# EAGLE schematic SNARFBASE-v03jj-232-buck (EAGLE 5.11)
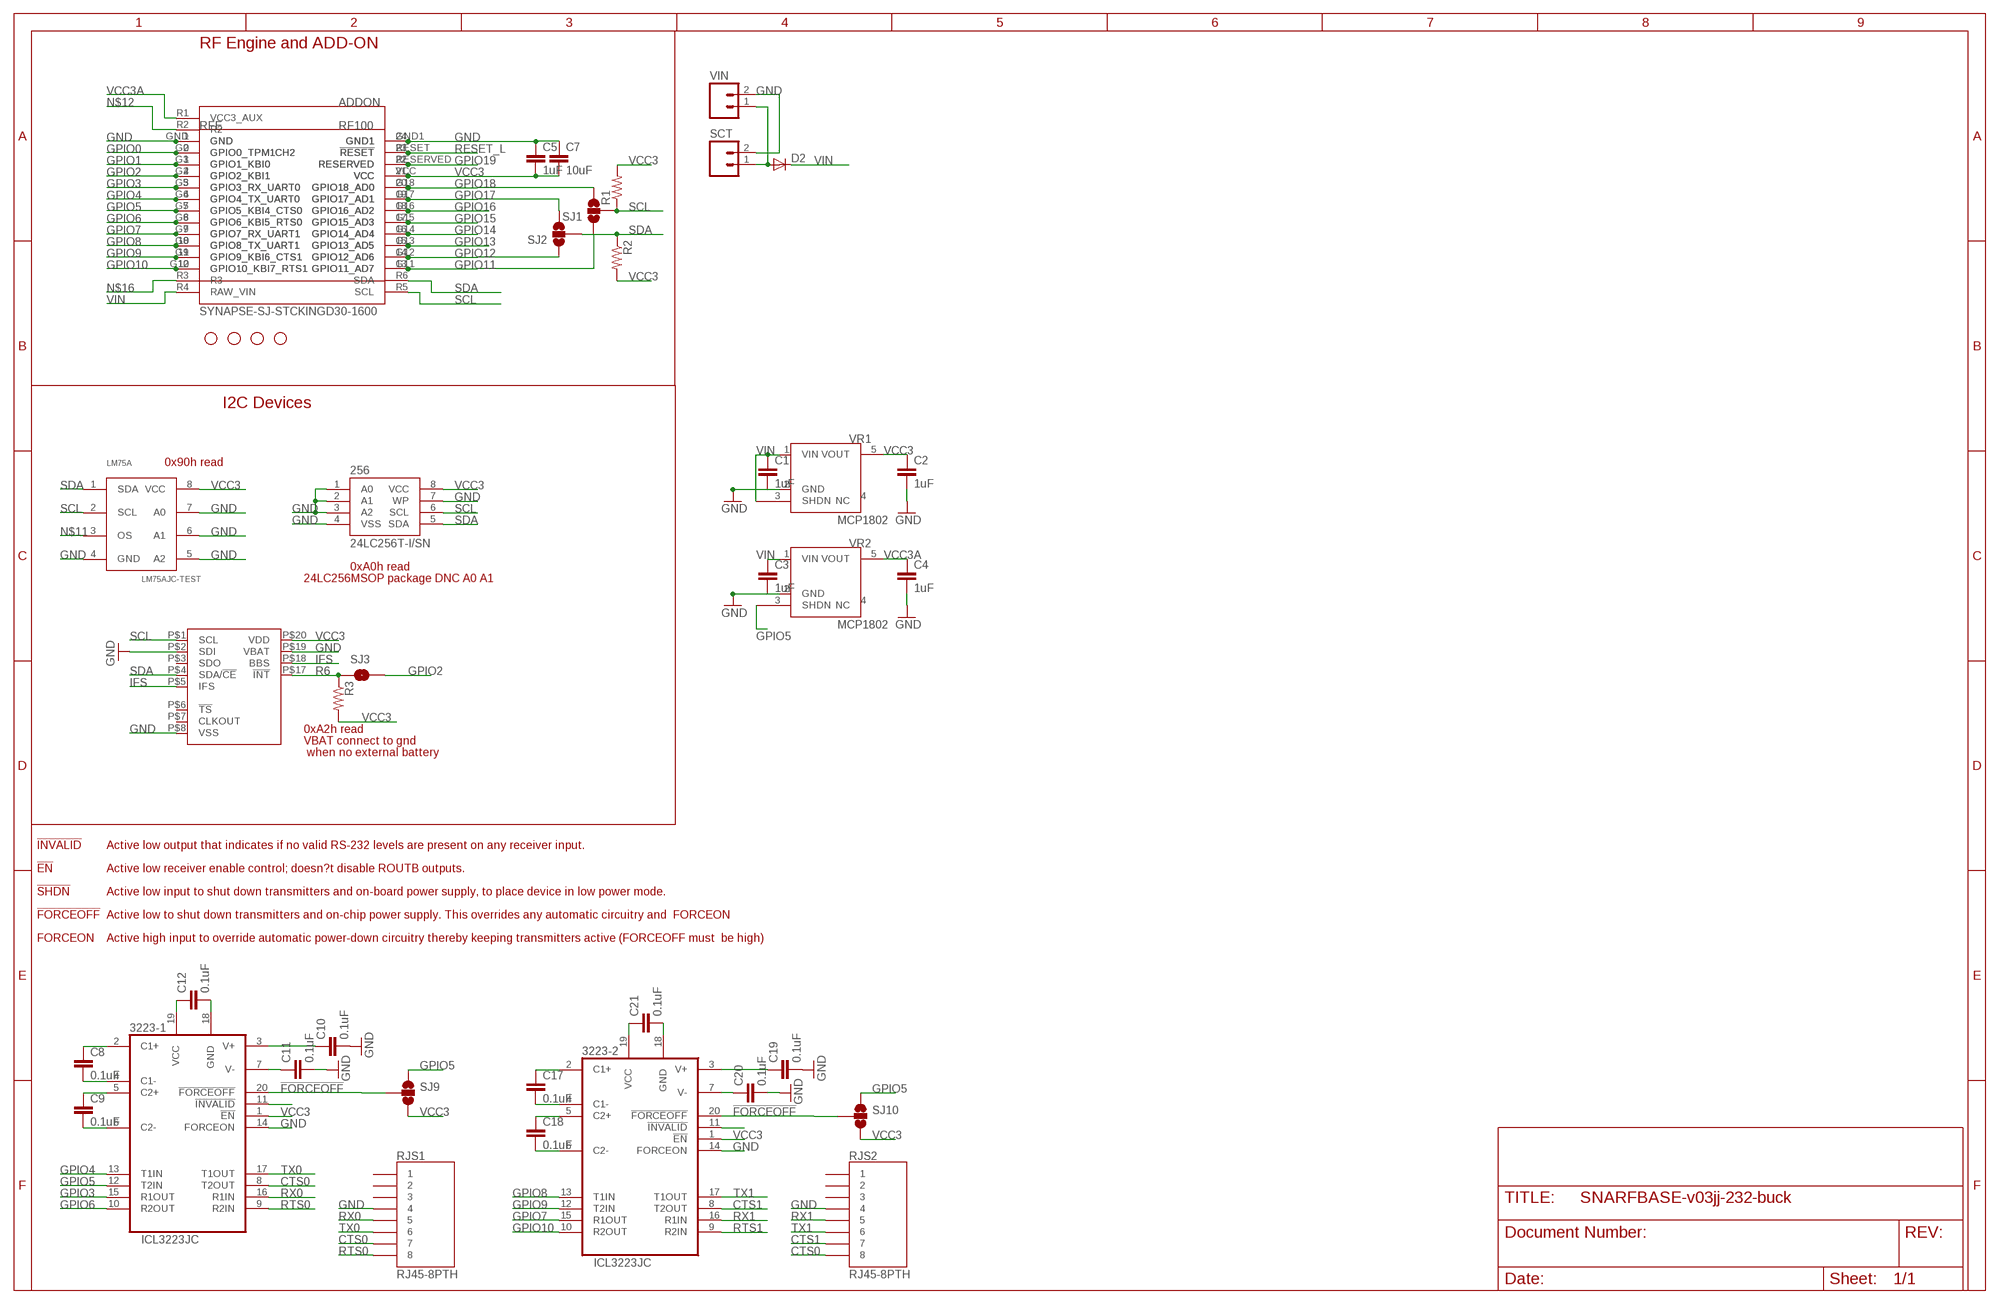
[diagram p0: schematic, sheet 1]

## Parts
256  24LC256T-I/SN  EEPROM-I2CSMD  [SO08]
3223-1  ICL3223JC  [TSSOP20-JC]
3223-2  ICL3223JC  [TSSOP20-JC]
ADDON  SYNAPSE-SJ-STCKINGD30-1600  [SYNSJ-STACK]
C1  1uF  CAP0805  [0805]
C2  1uF  CAP0805  [0805]
C3  1uF  CAP0805  [0805]
C4  1uF  CAP0805  [0805]
C5  1uF  CAP0805  [0805]
C7  10uF  CAP0805  [0805]
C8  0.1uF  CAP0805  [0805]
C9  0.1uF  CAP0805  [0805]
C10  0.1uF  CAP0805  [0805]
C11  0.1uF  CAP0805  [0805]
C12  0.1uF  CAP0805  [0805]
C17  0.1uF  CAP0805  [0805]
C18  0.1uF  CAP0805  [0805]
C19  0.1uF  CAP0805  [0805]
C20  0.1uF  CAP0805  [0805]
C21  0.1uF  CAP0805  [0805]
D2  DIODESMA  [SMA-DIODE]
JP6  STAND-OFF  [STAND-OFF]
JP9  STAND-OFF  [STAND-OFF]
JP10  STAND-OFF  [STAND-OFF]
JP11  STAND-OFF  [STAND-OFF]
LM75A  LM75AJC-TEST  [TSSOP8-3MM]
PCF2129A  PCF2129ASO20  [SO20W]
R1  RESISTOR  [0805]
R2  RESISTOR  [0805]
R3  RESISTOR  [0805]
RFE  RFE  RF100-JACKJACK2  [SYNAPSERFENGINE-THM-SMT-JACK2]
RJS1  RJ45-8PTH  [RJ45-8]
RJS2  RJ45-8PTH  [RJ45-8]
SCT  M023.5MM  [SCREWTERMINAL-3.5MM-2]
SJ1  SOLDERJUMPER_2WAYS  [SJ_3]
SJ2  SOLDERJUMPER_2WAYS  [SJ_3]
SJ3  SOLDERJUMPERNC2  [SJ_2S-NOTRACE]
SJ9  SOLDERJUMPER_2WAYPASTE1&2  [SJ_3_PASTE1&2]
SJ10  SOLDERJUMPER_2WAYPASTE1&2  [SJ_3_PASTE1&2]
VIN  M02PTH  [1X02]
VR1  MCP1802  [SOT23-5]
VR2  MCP1802  [SOT23-5]

## Nets
!FORCEOFF: 3223-1.20(!FORCEOFF) 3223-2.20(!FORCEOFF) SJ9.2 SJ10.2
!INVALID1: 3223-1.11(!INVALID)
!INVALID2: 3223-2.11(!INVALID)
CTS0: 3223-1.8(T2OUT) RJS1.7 RJS2.8
CTS1: 3223-2.8(T2OUT) RJS2.7
GND: 256.1(A0) 256.2(A1) 256.3(A2) 256.4(VSS) 256.7(WP) 3223-1.14(FORCEON) 3223-1.18(GND) 3223-2.14(FORCEON) 3223-2.18(GND) ADDON.GND ADDON.GND1 C1.2 C2.2 C3.2 C4.2 C5.1 C7.1 C10.2 C11.2 C12.2 C19.2 C20.2 C21.2 LM75A.4(GND) LM75A.5(A2) LM75A.6(A1) LM75A.7(A0) PCF2129A.P$2(SDI) PCF2129A.P$8(VSS) PCF2129A.P$19(VBAT) RFE.1(GND) RFE.24(GND1) RFE.P1 RFE.P24 RFE.P201 RFE.P224 RJS1.4 RJS2.4 SCT.2 VIN.2 VR1.2(GND) VR2.2(GND)
GPIO0: ADDON.G0(GPIO0_TPM1CH2) RFE.2(GPIO0_TPM1CH2) RFE.P2 RFE.P202
GPIO1: ADDON.G1(GPIO1_KBI0) RFE.3(GPIO1_KBI0) RFE.P3 RFE.P203
GPIO2: ADDON.G2(GPIO2_KBI1) RFE.4(GPIO2_KBI1) RFE.P4 RFE.P204 SJ3.2
GPIO3: 3223-1.15(R1OUT) ADDON.G3(GPIO3_RX_UART0) RFE.5(GPIO3_RX_UART0) RFE.P5 RFE.P205
GPIO4: 3223-1.13(T1IN) ADDON.G4(GPIO4_TX_UART0) RFE.6(GPIO4_TX_UART0) RFE.P6 RFE.P206
GPIO5: 3223-1.12(T2IN) ADDON.G5(GPIO5_KBI4_CTS0) RFE.7(GPIO5_KBI4_CTS0) RFE.P7 RFE.P207 SJ9.1 SJ10.1 VR2.3(SHDN)
GPIO6: 3223-1.10(R2OUT) ADDON.G6(GPIO6_KBI5_RTS0) RFE.8(GPIO6_KBI5_RTS0) RFE.P8 RFE.P208
GPIO7: 3223-2.15(R1OUT) ADDON.G7(GPIO7_RX_UART1) RFE.9(GPIO7_RX_UART1) RFE.P9 RFE.P209
GPIO8: 3223-2.13(T1IN) ADDON.G8(GPIO8_TX_UART1) RFE.10(GPIO8_TX_UART1) RFE.P10 RFE.P210
GPIO9: 3223-2.12(T2IN) ADDON.G9(GPIO9_KBI6_CTS1) RFE.11(GPIO9_KBI6_CTS1) RFE.P11 RFE.P211
GPIO10: 3223-2.10(R2OUT) ADDON.G10(GPIO10_KBI7_RTS1) RFE.12(GPIO10_KBI7_RTS1) RFE.P12 RFE.P212
GPIO11: ADDON.G11(GPIO11_AD7) RFE.13(GPIO11_AD7) RFE.P13 RFE.P213 SJ1.1
GPIO12: ADDON.G12(GPIO12_AD6) RFE.14(GPIO12_AD6) RFE.P14 RFE.P214 SJ2.1
GPIO13: ADDON.G13(GPIO13_AD5) RFE.15(GPIO13_AD5) RFE.P15 RFE.P215
GPIO14: ADDON.G14(GPIO14_AD4) RFE.16(GPIO14_AD4) RFE.P16 RFE.P216
GPIO15: ADDON.G15(GPIO15_AD3) RFE.17(GPIO15_AD3) RFE.P17 RFE.P217
GPIO16: ADDON.G16(GPIO16_AD2) RFE.18(GPIO16_AD2) RFE.P18 RFE.P218
GPIO17: ADDON.G17(GPIO17_AD1) RFE.19(GPIO17_AD1) RFE.P19 RFE.P219 SJ2.3
GPIO18: ADDON.G18(GPIO18_AD0) RFE.20(GPIO18_AD0) RFE.P20 RFE.P220 SJ1.3
GPIO19: ADDON.RESERVED RFE.22(RESERVED) RFE.P22 RFE.P222
IFS: PCF2129A.P$5(IFS) PCF2129A.P$18(BBS)
N$4: 3223-1.2(C1+) C8.1
N$6: 3223-1.4(C1-) C8.2
N$7: 3223-1.3(V+) C10.1
N$8: 3223-1.7(V-) C11.1
N$11: LM75A.3(OS)
N$12: ADDON.R2
N$13: 3223-1.5(C2+) C9.1
N$14: 3223-1.6(C2-) C9.2
N$15: 3223-2.2(C1+) C17.1
N$16: ADDON.R3
N$17: 3223-2.4(C1-) C17.2
N$18: 3223-2.3(V+) C19.1
N$19: 3223-2.7(V-) C20.1
N$20: 3223-2.5(C2+) C18.1
N$21: 3223-2.6(C2-) C18.2
R6: PCF2129A.P$17(!INT) R3.1 SJ3.1
RESET_L: ADDON.RESET(!RESET) RFE.23(!RESET) RFE.P23 RFE.P223
RTS0: 3223-1.9(R2IN) RJS1.8
RTS1: 3223-2.9(R2IN)
RX0: 3223-1.16(R1IN) RJS1.5
RX1: 3223-2.16(R1IN) RJS2.5
SCL: 256.6(SCL) ADDON.R5(SCL) LM75A.2(SCL) PCF2129A.P$1(SCL) R1.1 SJ1.2
SDA: 256.5(SDA) ADDON.R6(SDA) LM75A.1(SDA) PCF2129A.P$4(SDA/!CE) R2.1 SJ2.2
TX0: 3223-1.17(T1OUT) RJS1.6
TX1: 3223-2.17(T1OUT) RJS2.6
VCC3: 256.8(VCC) 3223-1.1(!EN) 3223-1.19(VCC) 3223-2.1(!EN) 3223-2.19(VCC) ADDON.VCC C2.1 C5.2 C7.2 C12.1 C21.1 LM75A.8(VCC) PCF2129A.P$20(VDD) R1.2 R2.2 R3.2 RFE.21(VCC) RFE.P21 RFE.P221 SJ9.3 SJ10.3 VR1.5(VOUT)
VCC3A: ADDON.R1(VCC3_AUX) C4.1 VR2.5(VOUT)
VIN: ADDON.R4(RAW_VIN) C1.1 C3.1 D2.C VR1.1(VIN) VR1.3(SHDN) VR2.1(VIN)
VIN_PREDIODE: D2.A SCT.1 VIN.1
Unconnected: PCF2129A.P$3(SDO) PCF2129A.P$6(!TS) PCF2129A.P$7(CLKOUT) RJS1.1 RJS1.2 RJS1.3 RJS2.1 RJS2.2 RJS2.3 VR1.4(NC) VR2.4(NC)

## Notes on the sheet
- RF Engine and ADD-ON
- I2C Devices
- 0x90h read
- 0xA0h read
- 24LC256MSOP package DNC A0 A1
- 0xA2h read
- VBAT connect to gnd
- when no external battery
- !INVALID | Active low output that indicates if no valid RS-232 levels are present on any receiver input.
- !EN | Active low receiver enable control; doesn?t disable ROUTB outputs.
- !SHDN | Active low input to shut down transmitters and on-board power supply, to place device in low power mode.
- !FORCEOFF | Active low to shut down transmitters and on-chip power supply. This overrides any automatic circuitry and  FORCEON
- FORCEON | Active high input to override automatic power-down circuitry thereby keeping transmitters active (FORCEOFF must  be high)

## Library data of the parts
256 = SparkFun:EEPROM-I2C
3223-1 3223-2 = 0_jc-custom:ICL3223
ADDON = 0_jc-custom:SYNAPSE-SJ-STCKING: Standard layout for expansion modules using Synapse Wireless boards
C1-C5 C7-C12 C17-C21 = 0_jc-custom:CAP: Capacitor Standard 0603 ceramic capacitor, and 0.1" leaded capacitor.
D2 = SparkFun:DIODE: Diode These are standard reverse protection diodes and small signal diodes. SMA package can handle up to about 1A. SOD-323 can handle about 200mA. What the SOD-323 package when ordering, there are some mfgs out there that are 5-pin packages.
JP6 JP9-JP11 = SparkFun:STAND-OFF: Stand Off This is the mechanical footprint for a #4 phillips button head screw. Use the keepout ring to avoid running the screw head into surrounding components. SKU : PRT-00447
LM75A = 0_jc-custom:LM75A
PCF2129A = 0_jc-custom:PCF2129A
R1-R3 = SparkFun:RESISTOR: Resistor Basic schematic elements and footprints for 0603, 1206, and PTH 1/10th watt (small) resistors.
RFE = 0_jc-custom:RF100-JACK
RJS1 RJS2 = SparkFun:RJ45-8: RJ45 Jack Simple RJ45, 8-pin connection - connector for common Cat5, Cat5e, and Cat6 Ethernet cables. Footprint not yet proven in production. Connector sku is PRT-00643; Breakout PCB sku is BOB-00716.
SCT VIN = SparkFun:M02: Header 2 Standard 2-pin 0.1" header. Use with straight break away headers (SKU : PRT-00116), right angle break away headers (PRT-00553), swiss pins (PRT-00743), machine pins (PRT-00117), and female headers (PRT-00115). Molex polarized connector foot print use with SKU : PRT-08233 with associated crimp pins and housings.
SJ1 SJ2 SJ9 SJ10 = SparkFun:SOLDERJUMPER_2WAY: Solder Jumper 2 way solder jumper
SJ3 = SparkFun:SOLDERJUMPER: Solder Jumper Standard SMD solder jumper. Used to automate production. Two varients : Normally Open and Normally Closed are the same, but have different paste layers. NC will have a large amount of paste and should jumper during reflow.
VR1 VR2 = 0_jc-custom:MCP1802

## Net classes
0 default: width 0.254 mm
1 Power: width 0.508 mm
2 smallsignal: width 0.152 mm
3 stdsignal: width 0.254 mm